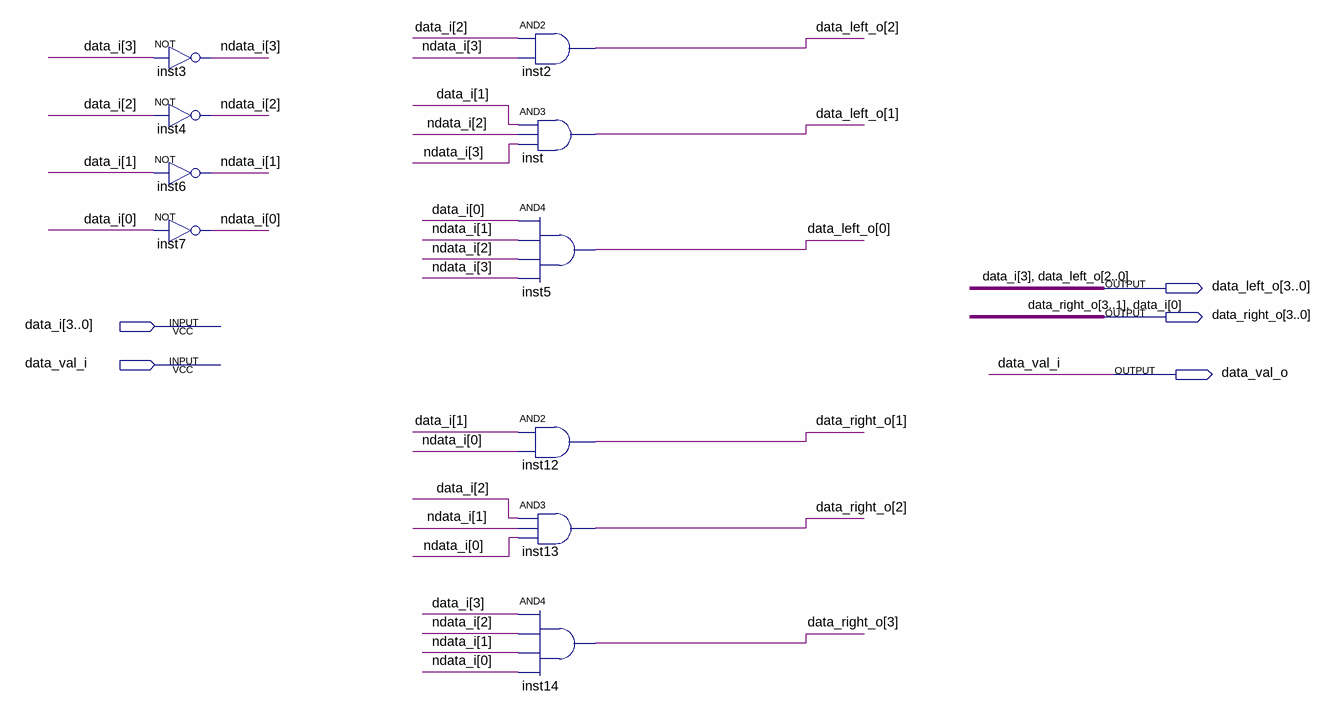
[diagram p0: schematic sheet]
// Quartus schematic priority_encoder_4.bdf as structural Verilog: 10 symbols, 5 pins
module priority_encoder_4 (
  input  [3:0] data_i,
  input  data_val_i,
  output [3:0] data_left_o,
  output [3:0] data_right_o,
  output data_val_o
);

  wire [3:0] ndata_i;

  not inst3 (ndata_i[3], data_i[3]);
  not inst4 (ndata_i[2], data_i[2]);
  not inst6 (ndata_i[1], data_i[1]);
  not inst7 (ndata_i[0], data_i[0]);
  and inst2 (data_left_o[2], data_i[2], ndata_i[3]);
  and inst (data_left_o[1], data_i[1], ndata_i[2], ndata_i[3]);
  and inst5 (data_left_o[0], data_i[0], ndata_i[1], ndata_i[2], ndata_i[3]);
  and inst12 (data_right_o[1], data_i[1], ndata_i[0]);
  and inst13 (data_right_o[2], data_i[2], ndata_i[1], ndata_i[0]);
  and inst14 (data_right_o[3], data_i[3], ndata_i[2], ndata_i[1], ndata_i[0]);

  assign data_left_o[3] = data_i[3];
  assign data_right_o[0] = data_i[0];
  assign data_val_o = data_val_i;
endmodule
